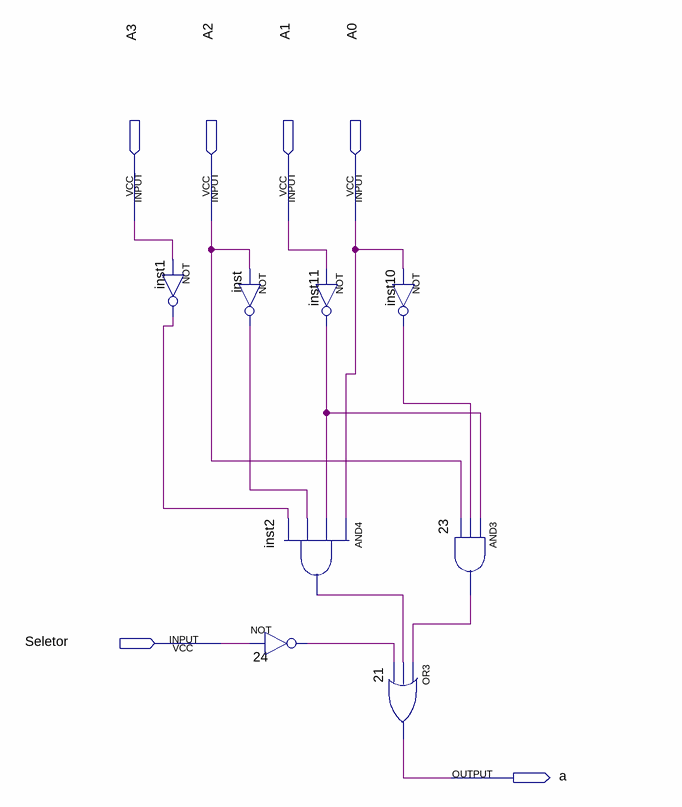
[diagram p0: schematic sheet]
// Quartus schematic segmento_a.bdf as structural Verilog: 8 symbols, 6 pins
module segmento_a (
  input  A3,
  input  A2,
  input  A1,
  input  A0,
  input  Seletor,
  output a
);

  wire inst1_out, inst2_out, inst10_out, inst11_out, inst_out, n23_out, n24_out;

  not inst1 (inst1_out, A3);
  not inst (inst_out, A2);
  and inst2 (inst2_out, A0, inst11_out, inst_out, inst1_out);
  not u_24 (n24_out, Seletor);
  not inst11 (inst11_out, A1);
  not inst10 (inst10_out, A0);
  and u_23 (n23_out, inst11_out, inst10_out, A2);
  or u_21 (a, n23_out, inst2_out, n24_out);
endmodule
